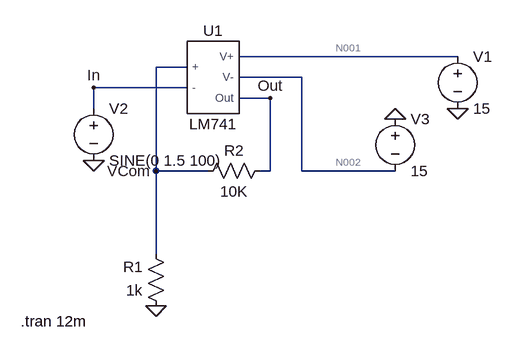
[diagram p0: schematic 4-7.asc]
4-7.asc, the LTspice schematic file:
Version 4.1
SHEET 1 880 680
WIRE 576 144 240 144
WIRE 160 160 112 160
WIRE 336 176 240 176
WIRE 160 192 16 192
WIRE 288 208 240 208
WIRE 16 224 16 192
WIRE 112 320 112 160
WIRE 192 320 112 320
WIRE 288 320 288 208
WIRE 288 320 272 320
WIRE 336 320 336 176
WIRE 480 320 336 320
WIRE 112 448 112 320
FLAG 16 304 0
FLAG 112 528 0
FLAG 576 224 0
FLAG 480 240 0
FLAG 112 320 VCom
FLAG 288 208 Out
FLAG 16 192 In
SYMBOL res 128 544 R180
WINDOW 0 36 76 Left 2
WINDOW 3 36 40 Left 2
SYMATTR InstName R1
SYMATTR Value 1k
SYMBOL res 176 336 R270
WINDOW 0 32 56 VTop 2
WINDOW 3 0 56 VBottom 2
SYMATTR InstName R2
SYMATTR Value 10K
SYMBOL voltage 576 128 R0
WINDOW 123 0 0 Left 0
WINDOW 39 0 0 Left 0
SYMATTR InstName V1
SYMATTR Value 15
SYMBOL voltage 16 208 R0
WINDOW 123 0 0 Left 0
WINDOW 39 0 0 Left 0
SYMATTR InstName V2
SYMATTR Value SINE(0 1.5 100)
SYMBOL voltage 480 224 R0
WINDOW 123 0 0 Left 0
WINDOW 39 0 0 Left 0
SYMATTR InstName V3
SYMATTR Value 15
SYMBOL LM741 192 176 R0
SYMATTR InstName U1
TEXT -96 552 Left 2 !.tran 12m

The netlist it stands for:
* 4-7.asc
R1 0 VCom 1k
R2 VCom Out 10K
V1 N001 0 15
V2 In 0 SINE(0 1.5 100)
V3 0 N002 15
X§U1 VCom In N001 N002 Out LM741  ; pins + - V+ V- Out
.tran 12m
.lib lm741.lib
.backanno
.end

* Results of the author's LTspice run, read from the files saved beside the schematic
* Operating Point, zero values left out:
*   V(n001) = 15 V
*   V(n002) = -15 V
*   V(out) = -10.42 mV
*   V(vcom) = -1 mV
*   I(R1) = 1 µA
*   I(R2) = 942.2 nA
*   I(V1) = -1.701 mA
*   I(V2) = -101.9 nA
*   I(V3) = -1.702 mA
*   Ix(u1:1) = 57.86 nA
*   Ix(u1:2) = 101.9 nA
*   Ix(u1:28) = 942.2 nA
*   Ix(u1:50) = -1.702 mA
*   Ix(u1:99) = 1.701 mA
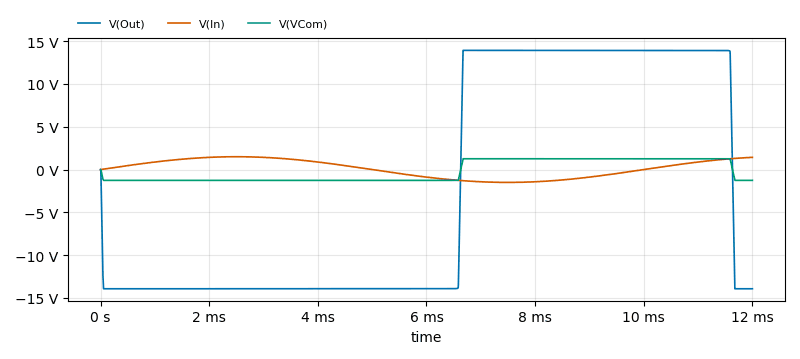
[diagram p1: Transient Analysis of 4-7.asc, plotted from the saved traces]
* Transient Analysis, 1 run:
*   V(Out): min -13.93 V, max 13.92 V, average -2.28 V, rms 13.84 V, last -13.92 V
*   V(In): min -1.5 V, max 1.5 V, average 137.5 mV, rms 1.04 V, last 1.427 V
*   V(VCom): min -1.266 V, max 1.265 V, average -206.7 mV, rms 1.255 V, last -1.261 V